# EAGLE design cpx-wroom32d (EAGLE 9.4.0)
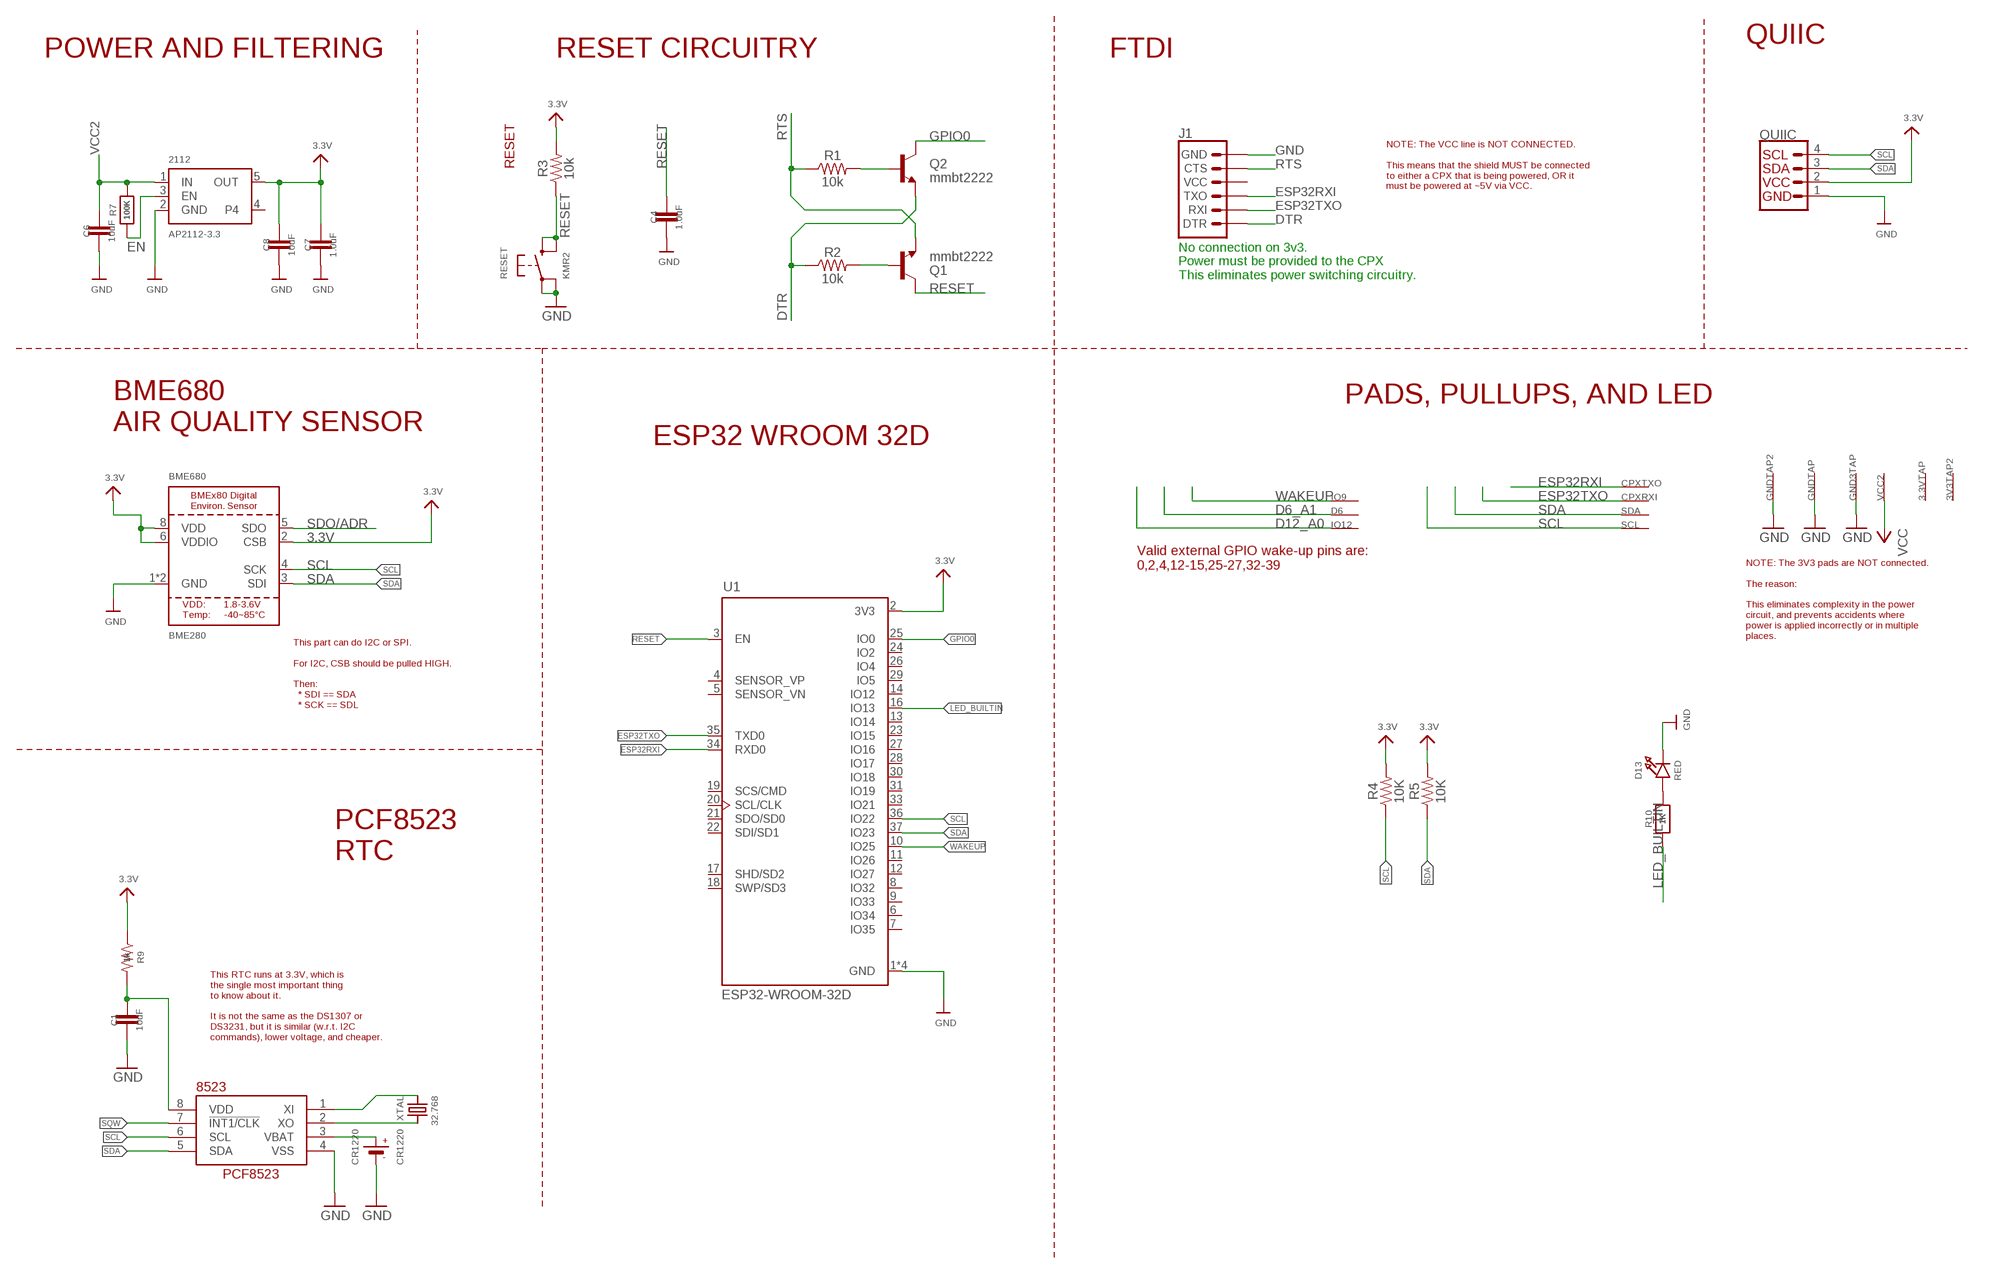
[diagram p0: schematic, sheet 1]

## Parts
3.3VTAP  SEWTAP-ALLIGATOR  [SEWALLI]
3V3TAP2  SEWTAP-ALLIGATOR  [SEWALLI]
2112  AP2112-3.3  VREG_SOT23-5  [SOT23-5]
8523  RTC_PCF8523T  [SOIC8_150MIL]
BME680  BME280  [BME280]
C1  10uF  10UF-0603-6.3V-20%  [0603]
C4  1.0uF  1.0UF-0603-16V-10%  [0603]
C6  10uF  10UF-0603-6.3V-20%  [0603]
C7  1.0uF  1.0UF-0603-16V-10%  [0603]
C8  10uF  10UF-0603-6.3V-20%  [0603]
CPXRXI  SEWTAP-ALLIGATOR  [SEWALLI]
CPXTXO  SEWTAP-ALLIGATOR  [SEWALLI]
CR1220  CR1220  BATTERYCR1220_SMT  [CR1220]
D6  SEWTAP-ALLIGATOR  [SEWALLI]
D13  RED  LED0805_NOOUTLINE  [CHIPLED_0805_NOOUTLINE]
GND3TAP  SEWTAP-ALLIGATOR  [SEWALLI]
GNDTAP  SEWTAP-ALLIGATOR  [SEWALLI]
GNDTAP2  SEWTAP-ALLIGATOR  [SEWALLI]
IO9  SEWTAP-ALLIGATOR  [SEWALLI]
IO12  SEWTAP-ALLIGATOR  [SEWALLI]
J1  6_PIN_SERIAL_TARGETRA_SMT  [6_PIN_SERIAL_TARGET_SIDE_RA_SMT]
Q1  mmbt2222  TRANSISTOR_NPNSOT23-3  [SOT23-3]
Q2  mmbt2222  TRANSISTOR_NPNSOT23-3  [SOT23-3]
QUIIC  QWIIC_CONNECTORJS-1MM  [1X04_1MM_RA]
R1  10k  10KOHM-0603-1/10W-1%  [0603]
R2  10k  10KOHM-0603-1/10W-1%  [0603]
R3  10k  10KOHM-0603-1/10W-1%  [0603]
R4  10K  4.7KOHM-0603-1/10W-1%  [0603]
R5  10K  4.7KOHM-0603-1/10W-1%  [0603]
R7  100K  RESISTOR_0603_NOOUT  [0603-NO]
R9  1k  1KOHM-0603-1/10W-1%  [0603]
R10  1K  RESISTOR_0603_NOOUT  [0603-NO]
RESET  KMR2  SWITCH_TACT_SMT4.6X2.8  [BTN_KMR2_4.6X2.8]
SCL  SEWTAP-ALLIGATOR  [SEWALLI]
SDA  SEWTAP-ALLIGATOR  [SEWALLI]
U1  ESP32-WROOM-32D  [MODULE_ESP32-WROOM-32D]
VCC2  SEWTAP-ALLIGATOR  [SEWALLI]
XTAL  32.768  CRYSTAL8.0X3.8  [CRYSTAL_8X3.8]

## Nets
3.3V: 2112.5(OUT) BME680.2(CSB) BME680.6(VDDIO) BME680.8(VDD) C7.1 C8.1 QUIIC.2(VCC) R3.2 R4.2 R5.2 R9.1 U1.2(3V3)
CLKVCC: 8523.8(VDD) C1.1 R9.2
D6_A1: D6.P$1(SEW)
D12_A0: IO12.P$1(SEW)
DTR: J1.1(DTR) Q2.2(E) R2.1
EN: 2112.3(EN) R7.1
ESP32RXI: CPXTXO.P$1(SEW) J1.2(TXO) U1.34(RXD0)
ESP32TXO: CPXRXI.P$1(SEW) J1.3(RXI) U1.35(TXD0)
GND: 2112.2(GND) 8523.4(VSS) BME680.1(GND) BME680.7(GND) C1.2 C4.2 C6.2 C7.2 C8.2 CR1220.- D13.C GND3TAP.P$1(SEW) GNDTAP2.P$1(SEW) GNDTAP.P$1(SEW) J1.6(GND) QUIIC.1(GND) RESET.A'(P1) RESET.A(P) U1.1(GND) U1.15(GND) U1.38(GND) U1.39(GND)
GPIO0: Q2.3(C) U1.25(IO0)
LED_BUILTIN: R10.1 U1.16(IO13)
N$5: D13.A R10.2
N$12: Q1.1(B) R2.2
N$13: Q2.1(B) R1.2
RESET: C4.1 Q1.3(C) R3.1 RESET.B'(S1) RESET.B(S) U1.3(EN)
RTS: J1.5(CTS) Q1.2(E) R1.1
SCL: 8523.6(SCL) BME680.4(SCK) QUIIC.4(SCL) R4.1 SCL.P$1(SEW) U1.36(IO22)
SDA: 8523.5(SDA) BME680.3(SDI) QUIIC.3(SDA) R5.1 SDA.P$1(SEW) U1.37(IO23)
SDO/ADR: BME680.5(SDO)
SQW: 8523.7(!INT1/CLK)
VBAT1: 8523.3(VBAT) CR1220.+$1(+)
VCC: VCC2.P$1(SEW)
VCC2: 2112.1(IN) C6.1 R7.2
WAKEUP: IO9.P$1(SEW) U1.10(IO25)
XI: 8523.1(XI) XTAL.P$1
XO: 8523.2(XO) XTAL.P$4
Unconnected: 3.3VTAP.P$1(SEW) 3V3TAP2.P$1(SEW) 2112.4 J1.4(VCC) U1.4(SENSOR_VP) U1.5(SENSOR_VN) U1.6(IO34) U1.7(IO35) U1.8(IO32) U1.9(IO33) U1.11(IO26) U1.12(IO27) U1.13(IO14) U1.14(IO12) U1.17(SHD/SD2) U1.18(SWP/SD3) U1.19(SCS/CMD) U1.20(SCL/CLK) U1.21(SDO/SD0) U1.22(SDI/SD1) U1.23(IO15) U1.24(IO2) U1.26(IO4) U1.27(IO16) U1.28(IO17) U1.29(IO5) U1.30(IO18) U1.31(IO19) U1.33(IO21)

## Notes on the sheet
- QUIIC
- POWER AND FILTERING | RESET CIRCUITRY | FTDI
- RESET
- NOTE: The VCC line is NOT CONNECTED.
  
  This means that the shield MUST be connected
  to either a CPX that is being powered, OR it
  must be powered at ~5V via VCC.
- No connection on 3v3.
  Power must be provided to the CPX
  This eliminates power switching circuitry.
- PADS, PULLUPS, AND LED
- BME680
  AIR QUALITY SENSOR
- ESP32 WROOM 32D
- Valid external GPIO wake-up pins are:
  0,2,4,12-15,25-27,32-39
- NOTE: The 3V3 pads are NOT connected.
  
  The reason:
  
  This eliminates complexity in the power 
  circuit, and prevents accidents where 
  power is applied incorrectly or in multiple 
  places.
- This part can do I2C or SPI.
  
  For I2C, CSB should be pulled HIGH.
  
  Then: 
    * SDI == SDA
    * SCK == SDL
- PCF8523
  RTC
- This RTC runs at 3.3V, which is
  the single most important thing
  to know about it.
  
  It is not the same as the DS1307 or 
  DS3231, but it is similar (w.r.t. I2C
  commands), lower voltage, and cheaper.

## Library data of the parts
3.3VTAP 3V3TAP2 CPXRXI CPXTXO D6 GND3TAP GNDTAP GNDTAP2 IO9 IO12 SCL SDA VCC2 = microbuilder:SEWTAP
2112 = microbuilder:VREG_SOT23-5: SOT23-5 Fixed Voltage Regulators Part Current Out V Out V In V Dropout θJA (°C/W) TJ (°C) Digikey Part No. ADP121 150mA 3.3V 3.4-5.5V 0.09V @ 150mA -- -- ADP121-AUJZ33R7CT-ND ADP121 150mA 3.0V 3.1-5.5V 0.09V @ 150mA -- -- ADP121-AUJZ30R7CT-ND ADP122 300mA 3.3V 3.4-5.5V 0.085V @ 300mA -- -- ADP122AUJZ-3.3-R7CT-ND ADP1712 300mA 3.3V 3.5-5.5V 0.17V @ 300mA -- -- ADP1712AUJZ-3.3-R7TR-ND AP7311 (Low Cost) 150mA 3.3V 3.5-6V 0.15V @ 150mA -- -- AP7311-33WG-7DICT-ND LD39015M18R 150mA 1.8V 1.9V-5.5V 0.08V @ 100mA -- -- 497-6977-1-ND LP2985A-33DBVR 150mA 3.3V 3.3-16V 0.28V @ 150mA 206 150 296-18479-1-ND MCP1824T-3302E/OT 300mA 3.3V 3.5V-6V 0.2V @ 300mA -- -- MCP1824T-3302E/OTCT-ND MIC5205-2.5YM5 TR 150mA 2.5V 2.7-16V 0.165V @ 150mA -- -- 576-1257-2-ND MIC5205-3.0YM5 TR 150mA 3.0V 3.2V-16V 0.165V @ 150mA -- -- 576-1258-2-ND MIC5205-3.3YM5 TR 150mA 3.3V 3.5V-16V 0.165V @ 150mA -- -- 576-1259-2-ND TPS780330220 150mA 3.3V+2.2V 3.6-5.5V 250mV Max -- -- 296-23332-1-ND TDA3663/N1,135 100mA 3.3V 3.5-45V 0.18V @ 50mA -- -- 568-5343-1-ND Max operating temp can be calculated using θJA, TJ (max junction temperature), and power in watts. Set the "Maximum Ambient Temperature" until it reaches TJ ("Max Junction Temperature"), which is the absolute limit for safe use of the regulator: Heat Sink Temperature Calculator <http://www.daycounter.com/Calculators/Heat-Sink-Temperature-Calculator.phtml> For example, With 12V source into a 3.3V LP2985 and a 30mA load, we are dissipating (12V-3.3V) * 0.03A = 0.261W. With a θJA of 206 °C/W, a TJ of 150°C, and 261mW we can safely use the chip without a heat sink up to 75°C (=147.1°C Junction Temperature).
8523 = microbuilder:RTC_PCF8523
BME680 = microbuilder:BME280: BME280 - Environmental Sensor (I2C + SPI)
C1 C6 C8 = SparkFun-Capacitors:10UF: 10.0µF ceramic capacitors A capacitor is a passive two-terminal electrical component used to store electrical energy temporarily in an electric field.; PROD_ID: CAP-11015
C4 C7 = SparkFun-Capacitors:1.0UF: 1µF ceramic capacitors A capacitor is a passive two-terminal electrical component used to store electrical energy temporarily in an electric field.; PROD_ID: CAP-00868
CR1220 = microbuilder:BATTERY: CR1220 SMT - Digikey: 3001K-ND CD2032 BAT-HLD-001 - Digikey: BAT-HLD-001-ND
D13 = microbuilder:LED: LED 0603 - 0603 Surface Mount Package 2mA: Green LED - Low Power (3.9mcd, 2ma, 1.7Vf) - Digikey: 475-2709-2-ND Orange LED - Low Power (9.8mcd, 2ma, 1.8Vf) - Digikey: 475-1194-2-ND Red LED - Low Power (5mcd, 2ma, 1.8Vf) - Digikey: 475-1195-2-ND Yellow LED - Low Power (7mcd, 2ma, 1.8Vf) - Digikey: 475-1196-2-ND 5mA: Blue LED - Low Power (17mcd, 5ma, 2.9Vf) - Digikey: LNJ937W8CRACT-ND 0805 - 0805 Surface Mount Package 2mA: Red LED (8.8mcd, 2mA, 1.8Vf, Clear) - Low Power [Digikey: 475-2510-1-ND] Green LED (5mcd, 2mA, 1.8Vf, Clear) - Low Power [Digikey: 475-2730-1-ND] Yellow LED (11.3mcd, 2mA, 1.8Vf, Clear) - Low Power [Digikey: 475-2555-1-ND] 20mA: Red LED (104mcd, 20mA, Diffused) - LS R976 [Digikey: 475-1278-6-ND] Red LED (12mcd, 20mA, 2.0Vf, Clear) - APT2012EC [Digikey: 754-1128-1-ND] Green LED (15mcd, 20mA, 2.2Vf, Clear) - APT2012GC [Digikey: 754-1131-1-ND] Orange LED (160mcd, 20mA, 2.1Vf, Clear) - APT2012SECK [Digikey: 754-1130-1-ND] 1206 - 1206 Surface Mount Package Green LED (26mcd, 20mA, Diffused) - LG N971 [Digikey: 475-1407-6-ND] Red LED (15mcd, 20mA, Diffused) - LH N974 [Digikey: 475-1416-6-ND] Cree - Cree High-Power Surface Mount LEDs XPEBWT-L1-0000-00D50 - White 111lm 350mA 2.9Vf 6200K 110° XTEAWT-00-0000-00000LEE3 - White 114lm 350mA 2.85Vf 5000K 115° Everlight - Everlight 45-21 Series Surface Mount LEDs 45-21/QK2C-B2832AC2CB2/2T - Warm White 2000mcd 20mA 3.25Vf 3050K 120° 45-21/LK2C-B38452C4CB2/2T - Nuetral White 2000mcd 20mA 3.25Vf 4150K 120° 45-21/LK2C-B50634C6CB2/2T - Cold White 2200mcd 20mA 3.25Vf 5650K 120° PLCC2 Reverse Mount LS T77K-J1L2-1-0-2-R18-Z - Red 11.25mcd 2mA 1.8Vf 630nm 120° LO T77K-L1M2-24-Z - Orange 19.6mcd 2mA 1.8Vf 606nm 120° LY T77K-K2M1-26-Z - Yellow 15.7mcd 2mA 1.8Vf 587nm 120°
J1 = SparkFun-Connectors:6_PIN_SERIAL_TARGET: 6-pin header connection for use with the "FTDI BASIC" pinout - TARGET SIDE. Also known as "Arduino Serial Program Header". It is used to mate with our FTDI Basic serial programmers using the Arduino IDE. Note, this device has "TARGET" in the name. It is intended to be used on a design that contains a target micro-controller that you wish to program. The "sister" device, named "CABLE" is inteneded to be used on a design that usually lives on the end of your USB cable and prvides the converter chip (FTDI232 or FTDI231x) to commnicate serial RX/TX. You can populate with some of these: Break Away Headers - Straight <https://www.sparkfun.com/products/116> (PRT-00116) For reference (or to suit your programming needs) check out these designs: SparkFun FTDI Basic Breakout - 5V <https://www.sparkfun.com/products/9716> (DEV-09716) SparkFun FTDI Basic Breakout - 3.3V <https://www.sparkfun.com/products/9873> (DEV-09873) SparkFun FTDI SmartBasic <https://www.sparkfun.com/products/12935> (DEV-12935) SparkFun Beefy 3 - FTDI Basic Breakout <https://www.sparkfun.com/products/13746> (DEV-13746); PROD_ID: CONN-08971
Q1 Q2 = SparkFun:TRANSISTOR_NPN: Transistor NPN BJT configuration in SOT23 package. MMBT2222 is the common NPN we use. Double check BCE configuration again layout.
QUIIC = SparkFun-Connectors:QWIIC_CONNECTOR: SparkFun I2C Standard Qwiic Connector An SMD 1mm pitch JST connector makes it easy and quick (get it? Qwiic?) to connect I2C devices to each other. The Qwiic system <http://www.sparkfun.com/qwiic> enables fast and solderless connection between popular platforms and various sensors and actuators. We carry 200mm <https://www.sparkfun.com/products/14204>, 100mm <https://www.sparkfun.com/products/14205>, 50mm <https://www.sparkfun.com/products/14206>, and breadboard friendly <https://www.sparkfun.com/products/14207> Qwiic cables. We also offer 10 pcs strips <https://www.sparkfun.com/products/14323> the SMD connectors.
R1-R3 = SparkFun-Resistors:10KOHM: 10kΩ resistor A resistor is a passive two-terminal electrical component that implements electrical resistance as a circuit element. Resistors act to reduce current flow, and, at the same time, act to lower voltage levels within circuits. - Wikipedia; PROD_ID: RES-00824
R4 R5 = SparkFun-Resistors:4.7KOHM: 4.7kΩ resistor A resistor is a passive two-terminal electrical component that implements electrical resistance as a circuit element. Resistors act to reduce current flow, and, at the same time, act to lower voltage levels within circuits. - Wikipedia; PROD_ID: RES-07857; VALUE: 4.7k
R7 R10 = microbuilder:RESISTOR: Resistors For new designs, use the packages preceded by an '_' character since they are more reliable: The following footprints should be used on most boards: _0402 - Standard footprint for regular board layouts _0603 - Standard footprint for regular board layouts _0805 - Standard footprint for regular board layouts _1206 - Standard footprint for regular board layouts For extremely tight-pitch boards where space is at a premium, the following 'micro-pitch' footprints can be used (smaller pads, no silkscreen outline, etc.): _0402MP - Micro-pitch footprint for very dense/compact boards _0603MP - Micro-pitch footprint for very dense/compact boards _0805MP - Micro-pitch footprint for very dense/compact boards _1206MP - Micro-pitch footprint for very dense/compact boards
R9 = SparkFun-Resistors:1KOHM: 1kΩ resistor A resistor is a passive two-terminal electrical component that implements electrical resistance as a circuit element. Resistors act to reduce current flow, and, at the same time, act to lower voltage levels within circuits. - Wikipedia; PROD_ID: RES-07856
RESET = microbuilder:SWITCH_TACT_SMT: SMT Tact Switches 6x6mm - Digikey: P12940SCT-ND KMR2 (4.6x2.8mm) - Digikey: 401-1426-1-ND EVQ-PQHB55 - Light Touch, 160GF (4.5x4.5mm) - Digikey: P8090SCT-ND KMT0 - KMT021 NGJ LHS (etc.) IP68/Waterproof - Digikey: CKN10289CT-ND
U1 = ESP32-WROOM-32D:ESP32-WROOM-32D: IC: SoC; GPIO, I2C, I2S, IR, SD, SDIO, SPI, UART; 2.7÷3.6VDC; 20dBm; AVAILABILITY: Unavailable; DESCRIPTION: IC: SoC; GPIO, I2C, I2S, IR, SD, SDIO, SPI, UART; 2.7÷3.6VDC; 20dBm; MF: Espressif Systems; MP: ESP32-WROOM-32D; PACKAGE: Module Espressif Systems; PRICE: None
XTAL = microbuilder:CRYSTAL: Crystals HC49UP - Surface Mount Crystal 4.0MHz 18pF +/-30ppm Surface Mount Crystal [Digikey: 535-9857-1-ND] 12.0 MHz Surface Mount Crystal [Digikey: 535-9869-6-ND] 25.0 MHz Surface Mount Crystal [Digikey: 535-9078-1-ND] 2.5 x 2.0mm - MEMs SMT Crystal 16.0 MHz 10pF 20ppm 2.5 x 2.0mm Crystal [Digikey -40-85°C: 535-10923-1-ND] 3.2 x 2.5mm - MEMs SMT Crystal 12.0 MHz 8pF 15ppm 3.2 x 2.5mm Crystal [Digikey: -10-70°C: 644-1047-1-ND -40-125°C: 644-1128-1-ND] 40~85°C cheaper: 644-1173-6-ND 16.0 MHz 8pF 15ppm 3.2 x 2.5mm Crystal [Digikey: -10-70°C: 644-1049-1-ND -40-125°C: 644-1129-2-ND]-40~85°C cheaper: 644-1175-6-ND 16.0 MHz 10pF 10ppm 3.2 x 2.5mm Crystal [Digikey: 644-1100-1-ND] 27.12 MHz 18pF 30ppm 3.2 x 2.5mm Crystal [Digikey: 887-1424-1-ND] 27.12MHz 10pF 10ppm 3.2 x 2.5mm Crystal [Digikey: 887-1329-1-ND] 4.9 x 1.8mm - MEMs SMT Crystal 32.768 KHz 12.5pF 20ppm 4.9 x 1.8mm Crystal [Digikey: SE2415CT-ND] 8.0 x 3.8mm - Surface Mount Crystal 32.768kHz 12.5pF 20ppm -40°C-85°C [Digikey: 535-9166-2-ND] Cylinder 32.768KHz Cylinder Crystal (2x6mm body) [Ex. Digikey: 300-8341-2-ND]

## Board
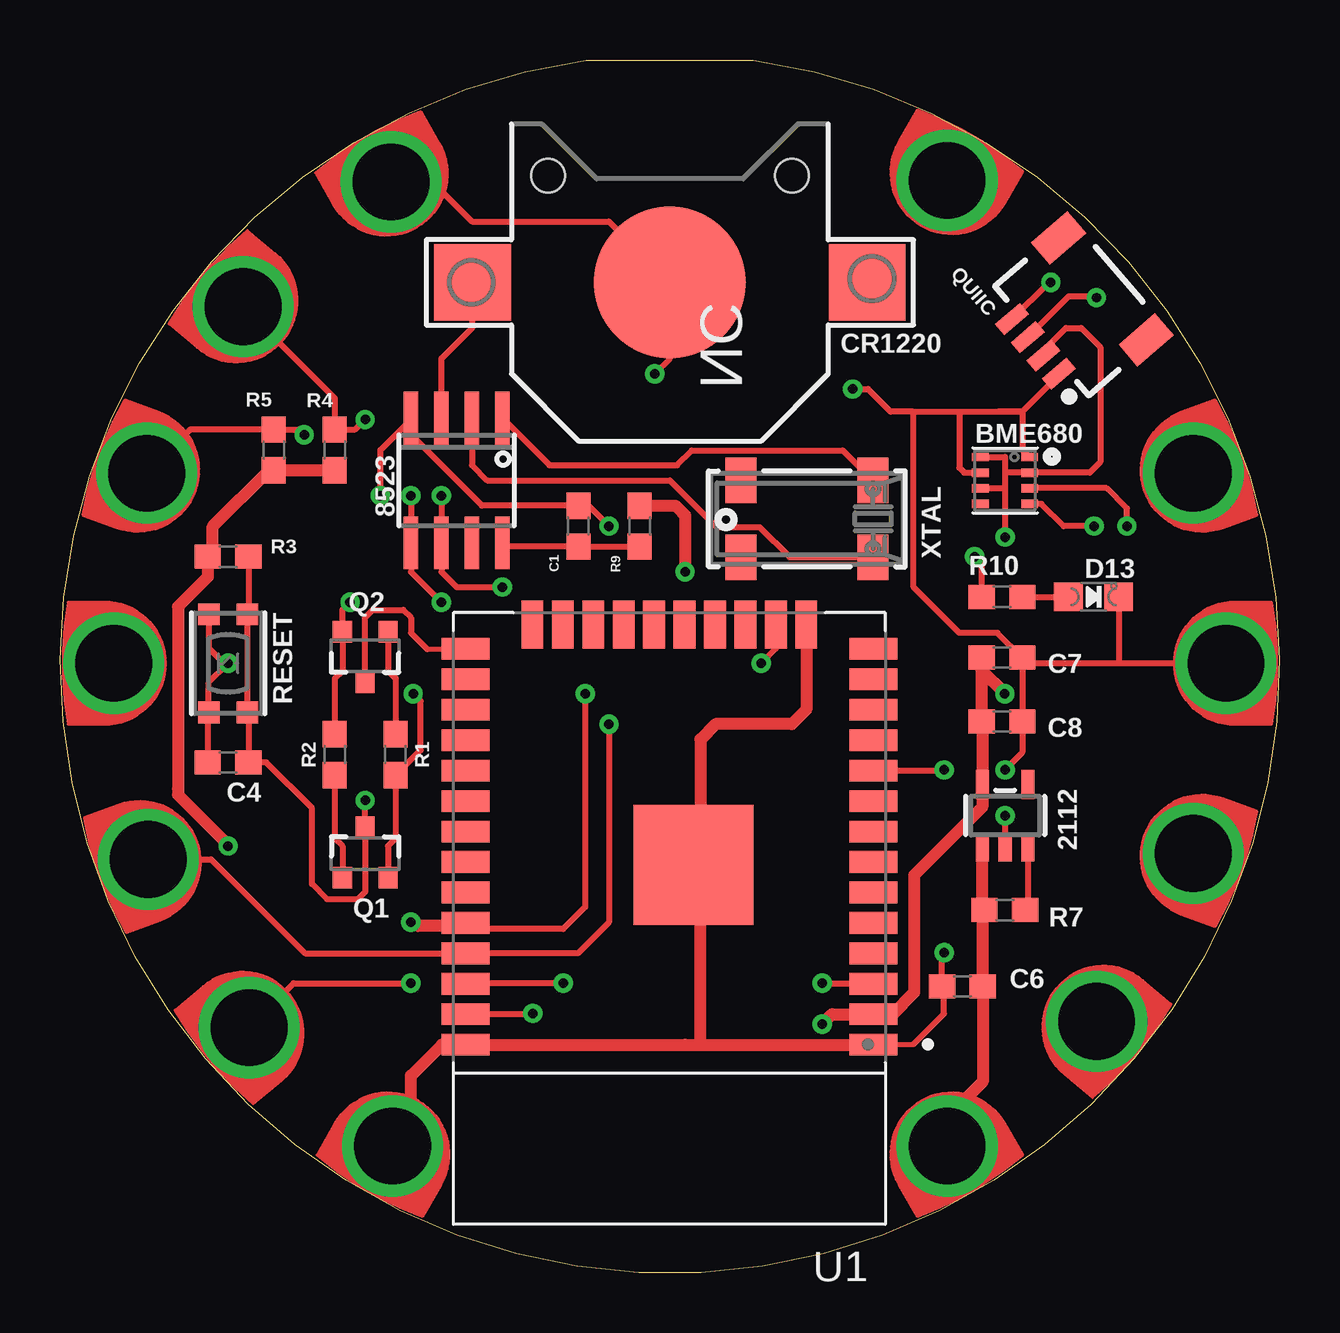
[diagram p1: board, top side]
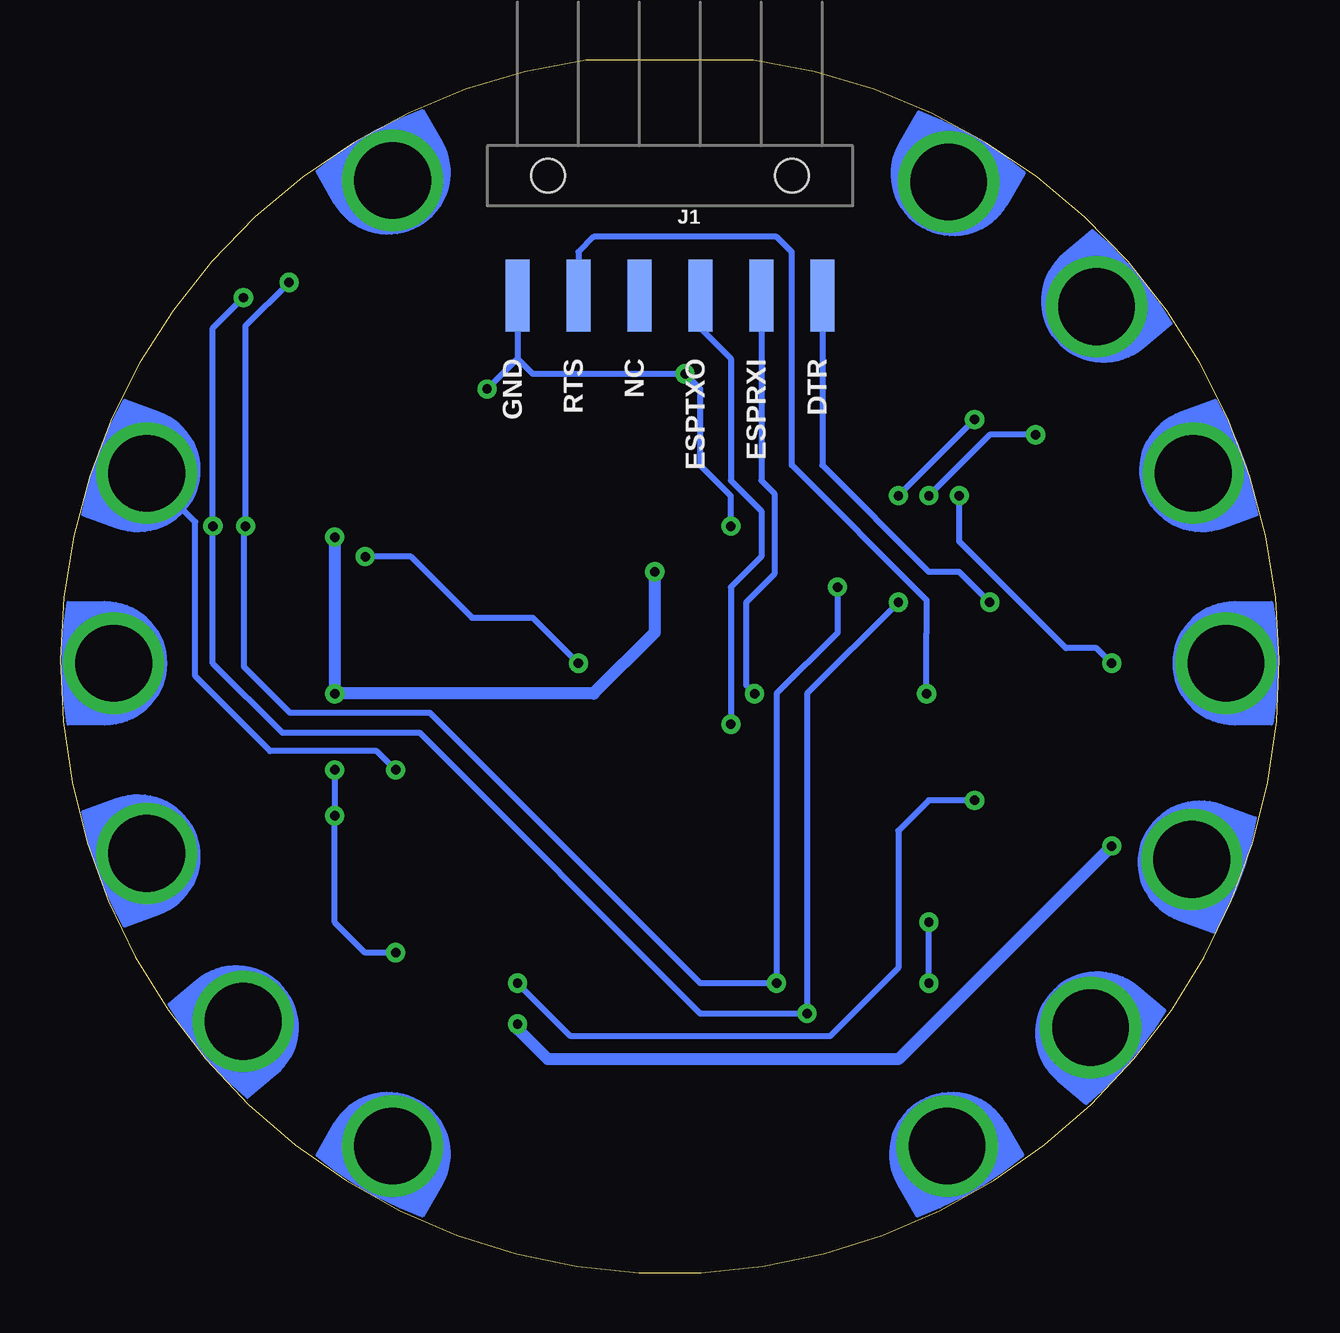
[diagram p2: board, bottom side, seen from below]

Size 50.82 x 50.55 mm. Coordinates in mm from the lower left corner, seen from the top.
Outline: 21.92,50.55 28.9,50.55 arc-344 21.92,50.55
Copper layers (1*16): Top 0.035mm / dielectric 1.5mm / Bottom 0.035mm
Design rules "adafruit *": minimum track width 8mil, minimum drill 15.5mil, track to track 8mil, track to pad 7mil, pad to pad 8mil, via to via 8mil, smd to smd 8mil, copper to edge 10mil, drill to drill 8mil, minimum pad ring 10mil, minimum via ring 8mil, stop-mask expansion 2mil, vias tented up to drill 20mil, thermal gap 10mil

### Footprints (pad centres in the part's own frame; a part is rotated, then mirrored left to right if it is on the bottom)
SEWALLI = drill 3.2: P$1 0,0.508
SOT23-5 = smd 0.55 x 1.2: 1 -0.95,-1.3; 2 0,-1.3; 3 0.95,-1.3; 4 0.95,1.3; 5 -0.95,1.3
SOIC8_150MIL = smd 0.6 x 2.2: 1 -1.905,-2.6; 2 -0.635,-2.6; 3 0.635,-2.6; 4 1.905,-2.6; 5 1.905,2.6; 6 0.635,2.6; 7 -0.635,2.6; 8 -1.905,2.6
BME280 = smd 0.7 x 0.35: 1 1.025,0.975; 2 1.025,0.325; 3 1.025,-0.325; 4 1.025,-0.975; 5 -1.025,-0.975; 6 -1.025,-0.325; 7 -1.025,0.325; 8 -1.025,0.975
0603 = smd 1.1 x 1: 1 -0.85,0; 2 0.85,0
CR1220 = smd 3.2 x 3.2: +$1 -8.225,0; +$2 8.225,0 | smd 6.35 x 6.35: - 0,0
CHIPLED_0805_NOOUTLINE = smd 1.2 x 1.2: A 0,-1.05; C 0,1.05
6_PIN_SERIAL_TARGET_SIDE_RA_SMT = smd 1 x 3: 1 -6.35,5; 2 -3.81,5; 3 -1.27,5; 4 1.27,5; 5 3.81,5; 6 6.35,5 | hole 1.4: -5.08,0; 5.08,0
SOT23-3 = smd 0.8 x 0.9: 1 -0.95,-1; 2 0.95,-1; 3 0,1.1
1X04_1MM_RA = smd 0.6 x 1.35: 1 -1.5,0; 2 -0.5,0; 3 0.5,0; 4 1.5,0 | smd 1.2 x 2: NC1 2.8,-3.675; NC2 -2.8,-3.675
0603-NO = smd 1.1 x 1: 1 -0.85,0; 2 0.85,0
BTN_KMR2_4.6X2.8 = smd 0.9 x 0.9: A 2.05,0.8; A' -2.05,0.8; B 2.05,-0.8; B' -2.05,-0.8
MODULE_ESP32-WROOM-32D = smd 2 x 0.9: 1 -8.5,5.26; 2 -8.5,3.99; 3 -8.5,2.72; 4 -8.5,1.45; 5 -8.5,0.18; 6 -8.5,-1.09; 7 -8.5,-2.36; 8 -8.5,-3.63; 9 -8.5,-4.9; 10 -8.5,-6.17; 11 -8.5,-7.44; 12 -8.5,-8.71; 13 -8.5,-9.98; 14 -8.5,-11.25; 25 8.5,-11.25; 26 8.5,-9.98; 27 8.5,-8.71; 28 8.5,-7.44; 29 8.5,-6.17; 30 8.5,-4.9; 31 8.5,-3.63; 32 8.5,-2.36; 33 8.5,-1.09; 34 8.5,0.18; 35 8.5,1.45; 36 8.5,2.72; 37 8.5,3.99; 38 8.5,5.26 | smd 0.9 x 2: 15 -5.715,-12.25; 16 -4.445,-12.25; 17 -3.175,-12.25; 18 -1.905,-12.25; 19 -0.635,-12.25; 20 0.635,-12.25; 21 1.905,-12.25; 22 3.175,-12.25; 23 4.445,-12.25; 24 5.715,-12.25 | smd 5 x 5: 39 -1,-2.24
CRYSTAL_8X3.8 = smd 1.3 x 1.9: P$1 -2.75,-1.6; P$2 2.75,-1.6; P$3 2.75,1.6; P$4 -2.75,1.6

### Placement (x,y rotation side)
3.3VTAP  2.74,25.4 90 top
3V3TAP2  36.71,45.09 330 top
2112  39.38,19.05 0 top
8523  16.52,33.02 180 top
BME680  39.38,33.02 0 top
C1  21.6,31.12 90 top
C4  6.99,21.27 180 top
C6  37.6,11.94 180 top
C7  39.25,25.63 0 top
C8  39.25,22.97 0 top
CPXRXI  4.14,17.4 110 top
CPXTXO  8.26,10.54 130 top
CR1220  25.41,41.28 0 top
D6  46.75,17.65 250 top
D13  43.06,28.17 270 top
GND3TAP  14.04,45.02 30 top
GNDTAP  48.08,25.4 270 top
GNDTAP2  14.11,5.72 150 top
IO9  46.75,33.15 290 top
IO12  42.81,10.8 230 top
J1  25.41,45.72 180 bottom
Q1  12.71,17.47 0 top
Q2  12.71,25.72 180 top
QUIIC  40.65,38.61 130.7 top
R1  13.98,21.59 90 top
R2  11.44,21.59 270 top
R3  6.99,29.85 180 top
R4  11.44,34.29 270 top
R5  8.9,34.29 270 top
R7  39.37,15.11 180 top
R9  24.14,31.12 270 top
R10  39.25,28.17 0 top
RESET  6.99,25.4 90 top
SCL  8.01,39.94 50 top
SDA  4.07,33.15 70 top
U1  25.38,14.76 180 top
VCC2  36.71,5.72 210 top
XTAL  31.12,31.42 180 top

### Tracks (layer width: path | path; a pad name or v marks a point on that pad's centre or on a via)
3.3V  (via drill 0.39)
  Top 0.254: 39,32.7 BME680.6 39.38,32.69 | BME680.8 39.38,34 39.38,33.33 | 39.38,33.33 39.38,32.69 | 39.38,33.33 39.4,33.35 BME680.2 42.9,33.35 43.34,33.78 43.34,38.58 42.55,39.37 41.92,39.37 40.98,38.43 QUIIC.2 | 39.38,32.69 v39.38,30.66
  Top 0.508: 2112.5 | C7.1 38.4,25.4 | 38.4,25.4 C8.1 38.43,22.94 2112.5 | 2112.5 38.43,19.41 35.58,16.57 35.58,11.68 34.67,10.77 U1.2 32.17,10.77 v31.76,10.36 | R4.2 R5.2 8.68,33.44 6.36,31.12 6.36,30.06 R3.2 6.14,29 4.91,27.76 4.91,20.17 4.91,19.92 7.02,17.81 v6.99,17.78 | R9.1 25.41,31.97 25.64,31.97 25.95,31.65 26.04,31.56 v26.04,29.21 | v39.37,24.13 38.4,25.1 38.4,25.4
  Bottom 0.254: v39.38,24.14 v39.37,24.13
  Bottom 0.508: v6.99,17.78 15.88,8.89 30.49,8.89 31.76,10.16 v31.76,10.36 | v26.04,29.21 26.04,26.67 28.58,24.13 v39.37,24.13 39.37,30.65 v39.38,30.66
CLKVCC
  Top 0.254: 8523.8 18.58,30.27 C1.1 R9.2
D6_A1
  Bottom 0.254: 47.05,17.65 D6.P$1
DTR  (via drill 0.39)
  Top 0.254: R2.1 11.44,24.77 11.76,25.09 Q2.2 11.76,27.63 v12.07,27.94
  Bottom 0.254: v12.07,27.94 12.71,28.58 13.34,29.21 14.61,29.21 19.06,33.66 J1.1
EN
  Top 0.254: 2112.3 40.33,15.23 R7.1
ESP32RXI  (via drill 0.39)
  Top 0.254: v21.88,24.13 21.88,15.24 20.96,14.33 14.89,14.33 v14.61,14.61 17.13,14.61 17.15,14.58 U1.34 | CPXTXO.P$1 9.73,12.07 v14.61,12.07
  Bottom 0.254: J1.2 21.6,33.02 21.06,32.48 21.06,29.12 22.23,27.94 22.23,24.49 v21.88,24.13 | v14.61,12.07 v14.61,14.61
ESP32TXO  (via drill 0.39)
  Top 0.254: CPXRXI.P$1 6.28,17.23 10.2,13.31 U1.35 21.57,13.31 22.87,14.61 v22.87,22.86
  Bottom 0.254: 3.06,17.27 3.1,17.23 CPXRXI.P$1 | J1.3 24.14,39.37 22.87,38.1 22.87,33.02 21.6,31.75 21.6,29.85 22.87,28.58 v22.87,22.86
GND  (via drill 0.39)
  Top 0.203: 35.57,9.53 35.54,9.5 U1.1
  Top 0.254: C6.2 36.75,12.07 | 36.75,12.07 36.75,13.34 v36.84,13.34 | v39.38,19.05 2112.2 | v39.38,20.96 40.1,21.68 C8.2 C7.2 | 35.57,9.53 36.84,10.8 36.84,11.98 36.75,12.07 | C4.2 6.14,23.3 RESET.A' 6.19,24.6 v6.99,25.4 6.83,25.4 6.19,26.04 RESET.A | GNDTAP.P$1 44.1,25.4 | 44.1,25.4 40.33,25.4 C7.2 | 14.61,35.56 14.61,34.93 17.57,31.97 C1.2 22.02,31.97 v22.87,31.12 | 14.61,35.56 8523.4 | 44.1,25.4 44.11,25.41 D13.C | C7.2 39.06,26.67 38.74,26.67 37.47,26.67 35.57,28.58 35.57,35.89 | v33.03,36.83 33.66,36.83 34.61,35.89 35.57,35.89 | v13.34,32.39 13.34,34.29 14.61,35.56 | v24.77,37.47 25.41,38.1 CR1220.- 22.87,43.82 17.15,43.82 15.51,45.46 GND3TAP.P$1 | 35.57,35.89 36.2,35.89 37.47,35.89 | BME680.7 37.68,33.35 37.47,33.55 37.47,35.89 | BME680.1 40.1,34.3 40.1,35.89 39.09,35.89 | QUIIC.1 41.63,37.42 40.09,35.89 39.09,35.89 | 37.47,35.89 39.09,35.89
  Top 0.508: GNDTAP2.P$1 14.61,6.04 14.61,8.21 15.9,9.5 U1.38 26.04,9.5 26.68,9.5 | 26.68,9.5 U1.1 | 26.68,9.5 26.68,16.51 | 26.68,16.51 26.68,16.7 U1.39 | U1.15 31.1,23.47 30.49,22.86 27.31,22.86 26.68,22.23 26.68,16.51
  Bottom 0.254: v36.84,13.34 38.11,13.34 39.38,14.61 v39.38,19.05 v39.38,20.96 | v22.87,31.12 22.87,32.37 24.14,33.64 24.14,36.83 v24.77,37.47 31.12,37.47 31.76,38.1 | J1.6 31.76,38.1 | 31.76,38.1 v33.03,36.83 | v6.99,25.4 7.63,26.04 8.9,26.04 13.34,30.48 v13.34,32.39
GPIO0
  Top 0.203: 15.3,25.99 16.86,25.99 U1.25
  Top 0.254: Q2.3 12.71,27.31 13.03,27.62 14.3,27.62 14.61,27.31 14.61,26.67 15.3,25.99
LED_BUILTIN  (via drill 0.39)
  Top 0.254: U1.16 29.83,26.01 v29.22,25.4 | v38.11,29.85 38.4,29.55 R10.1
  Bottom 0.254: v29.22,25.4 31.12,27.31 33.66,27.31 36.2,29.85 v38.11,29.85
N$5
  Top 0.254: R10.2 D13.A
N$12
  Top 0.254: R2.2 11.44,18.1 11.76,17.78 Q1.1
N$13
  Top 0.254: Q2.1 13.66,25.09 13.98,24.77 R1.2
RESET  (via drill 0.39)
  Top 0.254: R3.1 7.84,27.5 RESET.B RESET.B' 7.84,23.3 C4.1 8.58,21.27 10.49,19.37 10.49,16.19 11.12,15.56 12.39,15.56 12.71,15.88 Q1.3 v12.71,19.69 | v31.76,12.07 33.86,12.07 U1.3
  Bottom 0.254: v12.71,19.69 14.61,19.69 15.88,18.42 15.88,12.7 18.73,9.86 29.55,9.86 v31.76,12.07
RTS  (via drill 0.39)
  Top 0.254: Q1.2 13.66,17.78 13.98,18.1 R1.1 15.02,21.78 15.02,23.82 v14.71,24.13
  Bottom 0.254: v14.71,24.13 14.71,26.67 14.71,28.04 20.33,33.66 20.33,42.55 20.96,43.18 28.58,43.18 29.22,42.55 J1.5
SCL  (via drill 0.39)
  Top 0.254: SCL.P$1 11.44,36.45 R4.1 12.29,35.14 v12.71,35.56 | v18.42,28.58 16.52,28.58 15.88,29.21 8523.6 v15.88,32.39 | v20.96,12.07 17.79,12.07 17.76,12.04 U1.36 | v43.09,31.12 41.82,31.12 40.89,32.05 BME680.4 | v41.28,41.28 41.2,41.28 QUIIC.4
  Bottom 0.254: SCL.P$1 8.71,39.18 | v18.42,28.58 18.42,26.67 20.96,24.13 20.96,22.86 20.96,22.56 v20.96,12.07 24.14,12.07 35.42,23.34 41.26,23.34 43.16,25.25 43.16,31.05 v43.09,31.12 43.09,39.47 v41.28,41.28 | v12.71,35.56 v15.88,32.39
SDA  (via drill 0.39)
  Top 0.254: SDA.P$1 5.42,35.14 R5.1 9.95,35.14 v10.17,34.93 | v15.88,27.94 14.61,29.21 8523.5 v14.61,32.39 | v19.69,10.8 19.66,10.77 U1.37 | v44.46,31.12 44.46,31.85 43.62,32.7 BME680.3 | QUIIC.3 42.03,40.69 43.14,40.69 v43.19,40.64
  Bottom 0.254: v15.88,27.94 19.69,24.13 19.69,22.86 19.69,21.59 19.69,21.54 v19.69,10.8 24.15,10.8 35.85,22.5 41.56,22.5 44.46,25.4 v44.46,31.12 44.46,39.37 v43.19,40.64 | v10.17,34.93 12.07,34.93 v14.61,32.39
VBAT1
  Top 0.254: 8523.3 15.88,38.1 17.18,39.4 CR1220.+$1
VCC2
  Top 0.508: 36.2,5.72 38.45,7.96 C6.1 38.45,15.05 R7.2 38.43,15.2 2112.1
WAKEUP  (via drill 0.39)
  Top 0.254: U1.10 36.81,20.93 v36.84,20.96
  Bottom 0.254: 46.03,33.32 IO9.P$1 45.19,31.29 45.19,24.86 42.07,21.74 37.63,21.74 v36.84,20.96
XI
  Top 0.254: 8523.1 20.39,33.66 25.71,33.66 26.33,34.28 32.62,34.28 XTAL.P$1
XO
  Top 0.254: 8523.2 17.15,33.66 17.79,33.02 25.41,33.02 26.15,32.28 27.35,31.08 29.15,31.08 30.41,29.82 XTAL.P$4

### Text on the board
tNames: NC
bNames: DTR | ESPRXI | ESPTXO | NC | RTS | GND